# Altium schematic sheet 01 COVER PAGE.SchDoc
size 420 x 297 mm
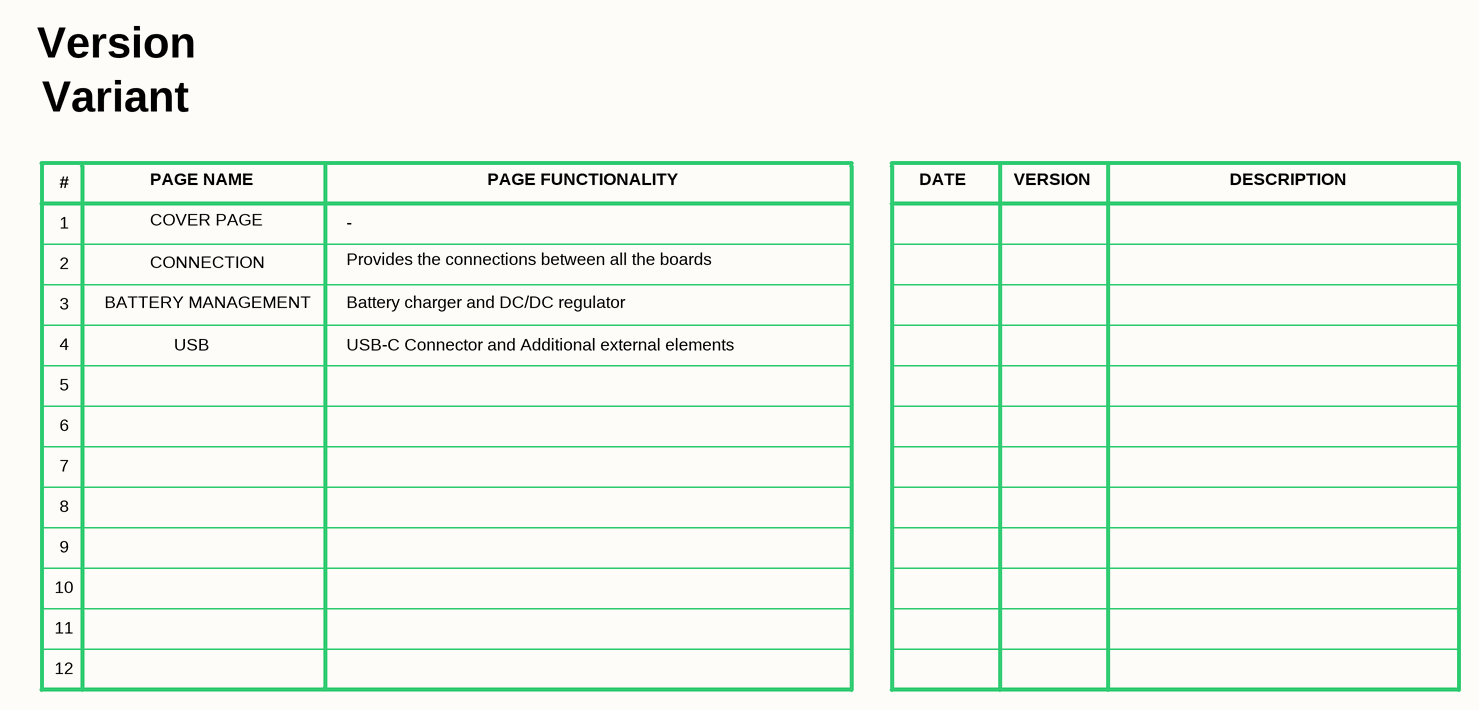
[diagram p0: 01 COVER PAGE.SchDoc]

## Notes on the sheet
- Version
- Variant
- #
- PAGE NAME
- PAGE FUNCTIONALITY
- DATE
- VERSION
- DESCRIPTION
- 1
- 2
- COVER PAGE
- CONNECTION
- -
- Provides the connections between all the boards
- 3
- 4
- USB
- BATTERY MANAGEMENT
- Battery charger and DC/DC regulator
- 5
- USB-C Connector and Additional external elements
- 6
- 7
- 8
- 9
- 10
- 11
- 12
- Title
- Project
- Size
- Date
- Revision
- A3